# EAGLE design sharp_esp32s2_v1 (EAGLE 9.6.2)
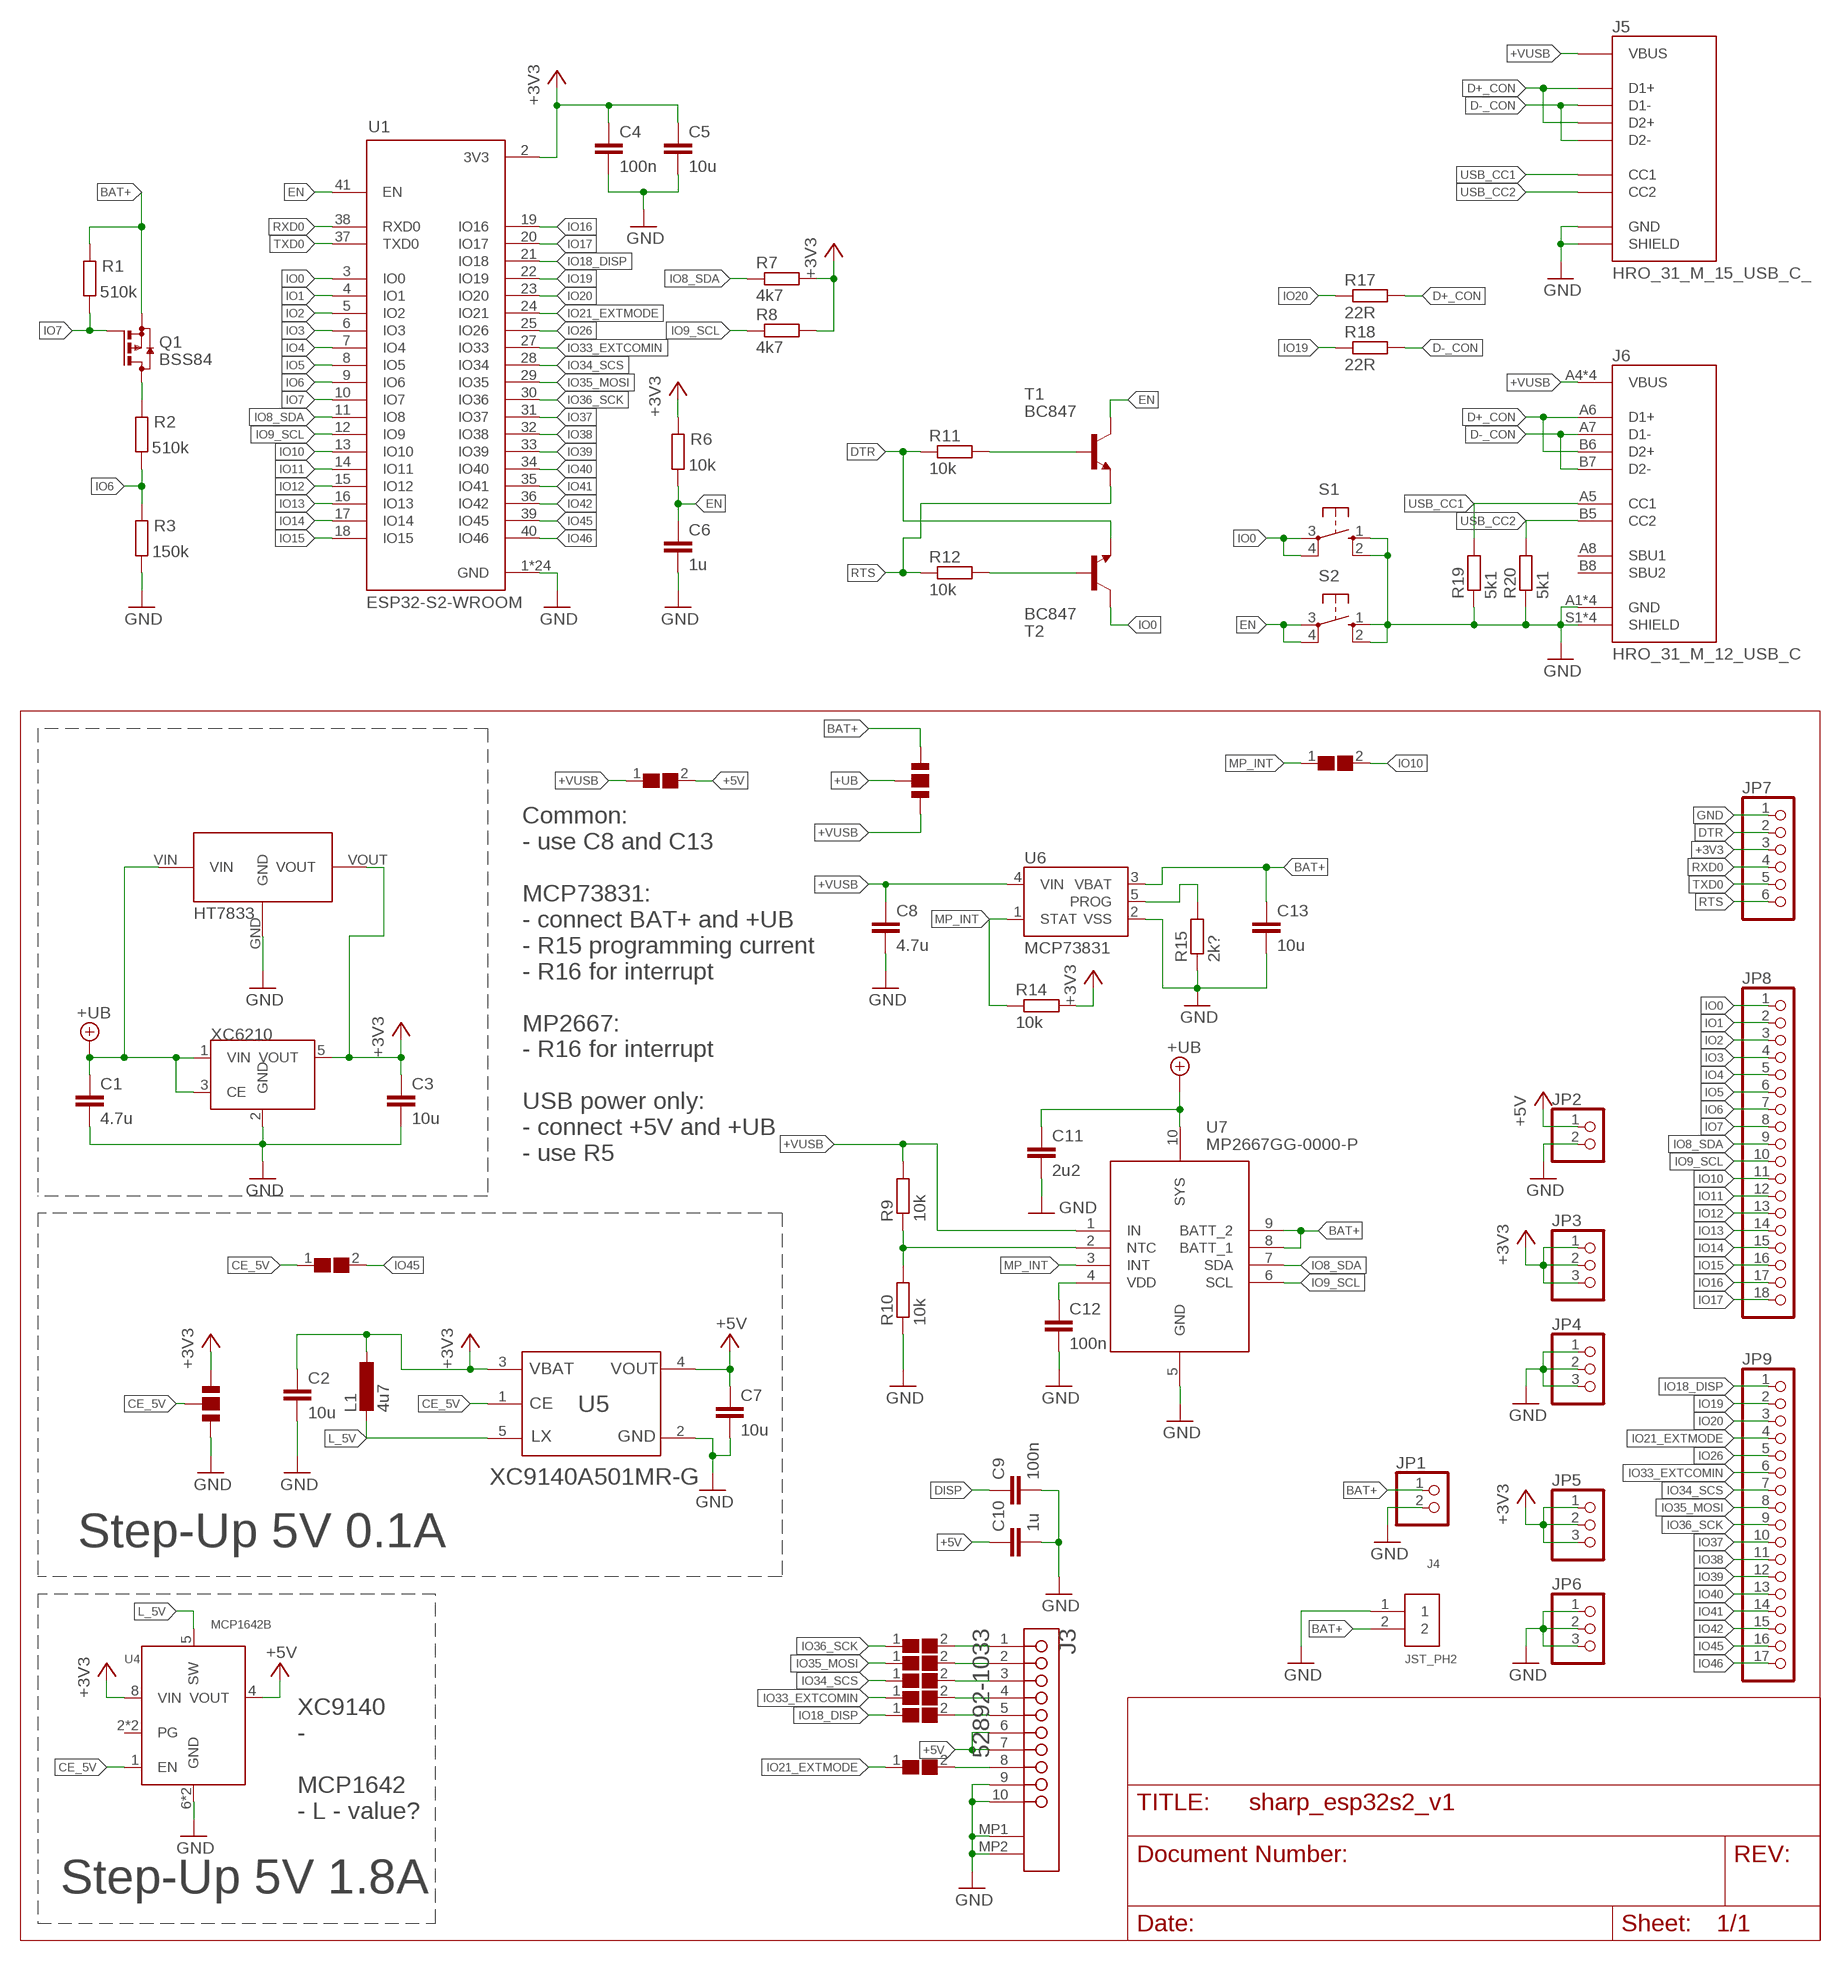
[diagram p0: schematic, sheet 1]

## Parts
C1  4.7u  C-EUC1206  [C1206]
C2  10u  C-EUC0603K  [C0603K]
C3  10u  C-EUC1206  [C1206]
C4  100n  C-EUC0603K  [C0603K]
C5  10u  C-EUC1206  [C1206]
C6  1u  C-EUC0603K  [C0603K]
C7  10u  C-EUC0603K  [C0603K]
C8  4.7u  C-EUC1206  [C1206]
C9  100n  C-EUC0603K  [C0603K]
C10  1u  C-EUC0603K  [C0603K]
C11  2u2  C-EUC1206  [C1206]
C12  100n  C-EUC0603K  [C0603K]
C13  10u  C-EUC1206  [C1206]
J1  JUMPER  [2-WAY]
J2  JUMPER  [2-WAY]
J3  MOLEX_52892-1033MOLEX_52892-1033_0_0  [MOLEX_52892-1033_0]
J4  JST_PH2  [JSTPH2]
J5  HRO_31_M_15_USB_C_  [HRO_31_M_15_USB_C]
J6  HRO_31_M_12_USB_C  [HRO_31_M_12_USB_C]
JP1  PINHD-1X2  [1X02]
JP2  PINHD-1X2  [1X02]
JP3  PINHD-1X3  [1X03]
JP4  PINHD-1X3  [1X03]
JP5  PINHD-1X3  [1X03]
JP6  PINHD-1X3  [1X03]
JP7  PINHD-1X6  [1X06]
JP8  PINHD-1X18  [1X18]
JP9  PINHD-1X17  [1X17]
L1  4u7  L-EUL3225M  [L3225M]
Q1  BSS84  [SOT23]
R1  510k  R-EU_R0603  [R0603]
R2  510k  R-EU_R0603  [R0603]
R3  150k  R-EU_R0603  [R0603]
R6  10k  R-EU_R0603  [R0603]
R7  4k7  R-EU_R0603  [R0603]
R8  4k7  R-EU_R0603  [R0603]
R9  10k  R-EU_R0603  [R0603]
R10  10k  R-EU_R0603  [R0603]
R11  10k  R-EU_R0603  [R0603]
R12  10k  R-EU_R0603  [R0603]
R14  10k  R-EU_R0603  [R0603]
R15  2k?  R-EU_R0603  [R0603]
R17  22R  R-EU_R0603  [R0603]
R18  22R  R-EU_R0603  [R0603]
R19  5k1  R-EU_R0603  [R0603]
R20  5k1  R-EU_R0603  [R0603]
S1  10-XX  [B3F-10XX]
S2  10-XX  [B3F-10XX]
T1  BC847  [SOT23]
T2  BC847  [SOT23]
U1  ESP32-S2-WROOM  [XCVR_ESP32-S2-WROOM]
U2  HT7833  [SOT89]
U3  XC6210  [SOT-23-5]
U4  MCP1642B  [MSOP8]
U5  TOREX_XC9140A501MR-GTOREX_XC9140A501MR-G_0_0  [TOREX_XC9140A501MR-G_0]
U6  MCP73831  [SOT95P290X120-5]
U7  MP2667GG-0000-P  [QFN50P200X200X105-10N]
U$1  SOLDER_JUMPER  [SOLDER_JUMPER]
U$2  SOLDER_JUMPER  [SOLDER_JUMPER]
U$3  SOLDER_JUMPER  [SOLDER_JUMPER]
U$4  SOLDER_JUMPER  [SOLDER_JUMPER]
U$5  SOLDER_JUMPER  [SOLDER_JUMPER]
U$6  SOLDER_JUMPER  [SOLDER_JUMPER]
U$7  SOLDER_JUMPER  [SOLDER_JUMPER]
U$8  SOLDER_JUMPER  [SOLDER_JUMPER]
U$9  SOLDER_JUMPER  [SOLDER_JUMPER]

## Nets
+3V3: C2.1 C3.1 C4.1 C5.1 J1.P$3 JP3.1 JP3.2 JP3.3 JP5.1 JP5.2 JP5.3 JP7.3 L1.1 R6.2 R7.2 R8.2 R14.2 U1.2(3V3) U2.VOUT U3.5(VOUT) U4.8(VIN) U5.3(VBAT)
+5V: C7.1 C10.1 J3.6 J3.7 JP2.1 U4.4(VOUT) U5.4(VOUT) U$7.2
+UB: C1.1 C11.1 J2.P$1 U2.VIN U3.1(VIN) U3.3(CE) U7.10(SYS)
+VUSB: C8.1 J2.P$2 J5.P$2(VBUS) J5.P$6(VBUS) J5.P$9(VBUS) J5.P$13(VBUS) J6.A4(VBUS) J6.A9(VBUS) J6.B4(VBUS) J6.B9(VBUS) R9.2 U6.4(VIN) U7.1(IN) U$7.1
BAT+: C13.1 J2.P$3 J4.2 JP1.1 Q1.2(S) R1.2 U6.3(VBAT) U7.8(BATT_1) U7.9(BATT_2)
CE_5V: J1.P$1 U4.1(EN) U5.1(CE) U$9.1
D+_CON: J5.P$4(D1+) J5.P$11(D2+) J6.A6(D1+) J6.B6(D2+) R17.2
D-_CON: J5.P$3(D1-) J5.P$10(D2-) J6.A7(D1-) J6.B7(D2-) R18.2
DISP: C9.1 J3.5 U$5.2
DTR: JP7.2 R11.1 T2.2(E)
EN: C6.1 R6.1 S2.3(P) S2.4(P1) T1.3(C) U1.41(EN)
GND: C1.2 C2.2 C3.2 C4.2 C5.2 C6.2 C7.2 C8.2 C9.2 C10.2 C11.2 C12.2 C13.2 J1.P$2 J3.9 J3.10 J3.MP1 J3.MP2 J4.1 J5.P$1(GND) J5.P$7(GND) J5.P$8(GND) J5.P$14(GND) J5.P$15(SHIELD) J5.P$16(SHIELD) J5.P$17(SHIELD) J5.P$18(SHIELD) J6.A1(GND) J6.A12(GND) J6.B1(GND) J6.B12(GND) J6.S1(SHIELD) J6.S2(SHIELD) J6.S3(SHIELD) J6.S4(SHIELD) JP1.2 JP2.2 JP4.1 JP4.2 JP4.3 JP6.1 JP6.2 JP6.3 JP7.1 R3.1 R10.1 R15.1 R19.1 R20.1 S1.1(S) S1.2(S1) S2.1(S) S2.2(S1) U1.1(GND) U1.26(GND) U1.42(GND) U1.43.1(GND) U1.43.2(GND) U1.43.3(GND) U1.43.4(GND) U1.43.5(GND) U1.43.6(GND) U1.43.7(GND) U1.43.8(GND) U1.43.9(GND) U1.43.10(GND) U1.43.11(GND) U1.43.12(GND) U1.43.13(GND) U1.43.14(GND) U1.43.15(GND) U1.43.16(GND) U1.43.17(GND) U1.43.18(GND) U1.43.19(GND) U1.43.20(GND) U1.43.21(GND) U2.GND U3.2(GND) U4.6(GND) U4.7(GND) U5.2(GND) U6.2(VSS) U7.5(GND)
IO0: JP8.1 S1.3(P) S1.4(P1) T2.3(C) U1.3(IO0)
IO1: JP8.2 U1.4(IO1)
IO2: JP8.3 U1.5(IO2)
IO3: JP8.4 U1.6(IO3)
IO4: JP8.5 U1.7(IO4)
IO5: JP8.6 U1.8(IO5)
IO6: JP8.7 R2.1 R3.2 U1.9(IO6)
IO7: JP8.8 Q1.1(G) R1.1 U1.10(IO7)
IO8_SDA: JP8.9 R7.1 U1.11(IO8) U7.7(SDA)
IO9_SCL: JP8.10 R8.1 U1.12(IO9) U7.6(SCL)
IO10: JP8.11 U1.13(IO10) U$8.2
IO11: JP8.12 U1.14(IO11)
IO12: JP8.13 U1.15(IO12)
IO13: JP8.14 U1.16(IO13)
IO14: JP8.15 U1.17(IO14)
IO15: JP8.16 U1.18(IO15)
IO16: JP8.17 U1.19(IO16)
IO17: JP8.18 U1.20(IO17)
IO18_DISP: JP9.1 U1.21(IO18) U$5.1
IO19: JP9.2 R18.1 U1.22(IO19)
IO20: JP9.3 R17.1 U1.23(IO20)
IO21_EXTMODE: JP9.4 U1.24(IO21) U$6.1
IO26: JP9.5 U1.25(IO26)
IO33_EXTCOMIN: JP9.6 U1.27(IO33) U$4.1
IO34_SCS: JP9.7 U1.28(IO34) U$3.1
IO35_MOSI: JP9.8 U1.29(IO35) U$2.1
IO36_SCK: JP9.9 U1.30(IO36) U$1.1
IO37: JP9.10 U1.31(IO37)
IO38: JP9.11 U1.32(IO38)
IO39: JP9.12 U1.33(IO39)
IO40: JP9.13 U1.34(IO40)
IO41: JP9.14 U1.35(IO41)
IO42: JP9.15 U1.36(IO42)
IO45: JP9.16 U1.39(IO45) U$9.2
IO46: JP9.17 U1.40(IO46)
L_5V: L1.2 U4.5(SW) U5.5(LX)
MP_INT: R14.1 U6.1(STAT) U7.3(INT) U$8.1
N$1: J3.2 U$2.2
N$4: J3.3 U$3.2
N$7: J3.4 U$4.2
N$8: Q1.3(D) R2.2
N$10: J3.8 U$6.2
N$14: R9.1 R10.2 U7.2(NTC)
N$17: R15.2 U6.5(PROG)
N$18: C12.1 U7.4(VDD)
N$28: R12.2 T2.1(B)
N$52: R11.2 T1.1(B)
RTS: JP7.6 R12.1 T1.2(E)
RXD0: JP7.4 U1.38(RXD0)
SCK: J3.1 U$1.2
TXD0: JP7.5 U1.37(TXD0)
USB_CC1: J5.P$5(CC1) J6.A5(CC1) R19.2
USB_CC2: J5.P$12(CC2) J6.B5(CC2) R20.2
Unconnected: J6.A8(SBU1) J6.B8(SBU2) U4.2(PG) U4.3(PG)

## Notes on the sheet
- Common:
  - use C8 and C13
  
  MCP73831:
  - connect BAT+ and +UB
  - R15 programming current
  - R16 for interrupt
  
  MP2667:
  - R16 for interrupt
  
  USB power only:
  - connect +5V and +UB
  - use R5
- Step-Up 5V 0.1A
- XC9140
  -
  
  MCP1642
  - L - value?
- Step-Up 5V 1.8A

## Library data of the parts
C1-C13 = rcl:C-EU: CAPACITOR, European symbol; SPICEPREFIX: C
J1 J2 = czech_maker:JUMPER
J3 = Bastlir:MOLEX_52892-1033: MOLX-52892-1033; CIIVA_IDS: 12958041; CIRCUITS_LOADED: 10; COMPONENT_LINK_1_DESCRIPTION: Manufacturer URL; COMPONENT_LINK_1_URL: http://www.molex.com/molex/index.jsp; COMPONENT_LINK_3_DESCRIPTION: Package Specification; COMPONENT_LINK_3_URL: http://www.molex.com/pdm_docs/sd/528921033_sd.pdf; CONTACT_POSITION: Bottom; CURRENT_MAX_PER_CONTACT: 0.5A; DATASHEET: http://www.molex.com/webdocs/datasheets/pdf/en-us/0528921033_FFC_FPC_CONNECTORS.pdf; DURABILITY_MATING_CYCLES_MAX: 20; ENTRY_ANGLE: 90degrees Angle; FOOTPRINT_VARIANT_NAME_0: Manufacturer Recommended; IMPORTED: yes; IMPORTED_FROM: vault; IMPORT_TS: 1521861772; MATED_HEIGHT: 2.00mm; MATERIAL___METAL: Phosphor Bronze; MATERIAL___PLATING_MATING: Silver, Tin-Bismuth; MATERIAL___PLATING_TERMINATION: Silver, Tin-Bismuth; MF: Molex; MOUNTING_TECHNOLOGY: Surface Mount; MPN: 52892-1033; NUMBER_OF_ROWS: 1; ORIENTATION: Right Angle; PACKAGE: 52892-1033; PACKAGE_DESCRIPTION: 10-Lead FPC Connector, Pitch 0.5 mm; PACKAGE_VERSION: Rev. A, 05/2013; PACKING: Tape and Reel; PCB_LOCATOR: No; PCB_RETENTION: Yes; PITCH___MATING_INTERFACE: 0.50mm; PITCH___TERMINATION_INTERFACE: 0.50mm; POLARIZED_TO_PCB: No; PREFIX: J; RELEASE_DATE: 1411372666; ROHS: Yes; STACKABLE: No; VAULT_GUID: ED90F1F9-BF1F-41FB-8C24-080009F071BA; VAULT_REVISION: 2519BB65-6747-4A90-BA56-D26D50506A67; VOLTAGE_MAX: 50V
J4 = Bastlir:JST_PH2
J5 = Bastlir:HRO_31_M_15_USB_C: datasheet <https://datasheet.lcsc.com/szlcsc/1811101526_Korean-Hroparts-Elec-TYPE-C-31-M-15_C223908.pdf>
J6 = Bastlir:HRO_31_M_12_USB_C: USB Shielded I/O Receptacle; Type C; Right Angle; Surface Mount; Gold over Nickel
JP1 JP2 = pinhead:PINHD-1X2: PIN HEADER
JP3-JP6 = pinhead:PINHD-1X3: PIN HEADER
JP7 = pinhead:PINHD-1X6: PIN HEADER
JP8 = pinhead:PINHD-1X18: PIN HEADER
JP9 = pinhead:PINHD-1X17: PIN HEADER
L1 = rcl:L-EU: INDUCTOR, European symbol; SPICEPREFIX: L
Q1 = transistor-small-signal:BSS84: P-CHANNEL MOS FET
R1-R3 R6-R12 R14 R15 R17-R20 = rcl:R-EU_: RESISTOR, European symbol; SPICEPREFIX: R
S1 S2 = switch-omron:10-XX: OMRON SWITCH; MPN: B3F-1000; OC_FARNELL: 176432; OC_NEWARK: 36M3542
T1 T2 = transistor:BC847: NPN TRANSISTOR
U1 = Bastlir:ESP32-S2-WROOM: WiFi 802.11b/g/n Transceiver Module 2.4GHz PCB Trace Surface Mount Check prices <https://pricing.snapeda.com/search/part/ESP32-S2-WROOM/?ref=eda>; AVAILABILITY: Bad; DESCRIPTION: WiFi 802.11b/g/n Transceiver Module 2.4GHz PCB Trace Surface Mount; MF: Espressif Systems; MP: ESP32-S2-WROOM; PACKAGE: VFQFN-56 Espressif Systems; PRICE: None
U2 = Bastlir:HT7833
U3 = Bastlir:XC6210
U4 = Bastlir:MCP1642B
U5 = Bastlir:TOREX_XC9140A501MR-G: Boost Switching Regulator IC Positive Fixed 5V 1 Output 295mA (Switch) SC-74A, SOT-753; AMBIENT_TEMPERATURE_RANGE_HIGH: +85°C; AMBIENT_TEMPERATURE_RANGE_LOW: -40°C; AUTOMOTIVE: No; CENTROID_NOT_SPECIFIED: No; DATASHEET: http://www.torexsemi.com/products/dcdc_converters/data/XC9140.pdf; DEVICE_CLASS_L1: Integrated Circuits (ICs); DEVICE_CLASS_L2: Power Management ICs; DEVICE_CLASS_L3: Voltage Regulators - Switching; DIGIKEY_DESCRIPTION: IC REG BOOST 5V 295MA SOT25; DIGIKEY_PART_NUMBER: 893-1181-1-ND; FOOTPRINT_PARAMETERS_1: {"fp_type":"SOT23","params":{"N":{"default":"5","long name":"Number of leads","type":"multichoice","short name":"N"},"A":{"nom":false,"long name":"Height","min":false,"max":1300000,"short name":"A","type":"measurement"},"A1":{"nom":50000,"long name":"Package clearance","min":0,"max":100000,"short name":"A1","type":"measurement"},"A2":{"nom":1100000,"long name":"Package height","min":1000000,"max":1200000,"short name":"A2","type":"measurement"},"D":{"nom":2900000,"long name":"Package length","min":2700000,"max":3100000,"short name":"D","type":"measurement"},"E":{"nom":2800000,"long name":"Width /w leads","min":2600000,"max":3000000,"short name":"E","type":"measurement"},"E1":{"nom":1600000,"long name":"Package width","min":1500000,"max":1800000,"short name":"E1","type":"measurement"},"B":{"nom":400000,"long name":"Lead width","min":350000,"max":500000,"short name":"B","type":"measurement"},"C":{"nom":150000,"long name":"Lead thickness","min":100000,"max":250000,"short name":"C","type":"measurement"},"L":{"nom":false,"long name":"Lead foot length","min":200000,"max":false,"short name":"L","type":"measurement"},"e":{"nom":950000,"long name":"Lead pitch","min":null,"max":null,"short name":"e","type":"measurement"},"PHI":{"nom":false,"long name":"Lead angle","min":0,"max":8,"short name":"PHI","type":"measurement"},"offset x":{"nom":0,"long name":"X Center offset","min":null,"max":null,"short name":"offset x","type":"measurement"},"offset y":{"nom":0,"long name":"Y Center offset","min":null,"max":null,"short name":"offset y","type":"measurement"},"LS":{"default":"Rounded rectangle","long name":"Land shape","type":"multichoice","short name":"LS"},"LS1":{"default":"Rectangle","long name":"Land shape (Pin 1)","type":"multichoice","short name":"LS1"},"solder toe":{"nom":550000,"long name":"Solder fillet (toe)","min":null,"max":null,"short name":"solder toe","type":"fixedmeasurement"},"solder heel":{"nom":450000,"long name":"Solder fillet (heel)","min":null,"max":null,"short name":"solder heel","type":"fixedmeasurement"},"solder side":{"nom":50000,"long name":"Solder fillet (side)","min":null,"max":null,"short name":"solder side","type":"fixedmeasurement"},"courtyard":{"nom":500000,"long name":"Courtyard","min":null,"max":null,"short name":"courtyard","type":"fixedmeasurement"},"SF":{"default":"A","long name":"Packing level","type":"multichoiceparent","short name":"SF","help":"http://support.upverter.com/customer/portal/articles/978783-what-is-a-footprint-packing-level","children":["solder toe","solder heel","solder side","courtyard"]}}}; FOOTPRINT_PARAMETERS_2: {"fp_type":"SOT23","params":{"N":{"default":"5","long name":"Number of leads","type":"multichoice","short name":"N"},"A":{"nom":false,"long name":"Height","min":false,"max":1300000,"short name":"A","type":"measurement"},"A1":{"nom":50000,"long name":"Package clearance","min":0,"max":100000,"short name":"A1","type":"measurement"},"A2":{"nom":1100000,"long name":"Package height","min":1000000,"max":1200000,"short name":"A2","type":"measurement"},"D":{"nom":2900000,"long name":"Package length","min":2700000,"max":3100000,"short name":"D","type":"measurement"},"E":{"nom":2800000,"long name":"Width /w leads","min":2600000,"max":3000000,"short name":"E","type":"measurement"},"E1":{"nom":1600000,"long name":"Package width","min":1500000,"max":1800000,"short name":"E1","type":"measurement"},"B":{"nom":400000,"long name":"Lead width","min":350000,"max":500000,"short name":"B","type":"measurement"},"C":{"nom":150000,"long name":"Lead thickness","min":100000,"max":250000,"short name":"C","type":"measurement"},"L":{"nom":false,"long name":"Lead foot length","min":200000,"max":false,"short name":"L","type":"measurement"},"e":{"nom":950000,"long name":"Lead pitch","min":null,"max":null,"short name":"e","type":"measurement"},"PHI":{"nom":false,"long name":"Lead angle","min":0,"max":8,"short name":"PHI","type":"measurement"},"offset x":{"nom":0,"long name":"X Center offset","min":null,"max":null,"short name":"offset x","type":"measurement"},"offset y":{"nom":0,"long name":"Y Center offset","min":null,"max":null,"short name":"offset y","type":"measurement"},"LS":{"default":"Rounded rectangle","long name":"Land shape","type":"multichoice","short name":"LS"},"LS1":{"default":"Rectangle","long name":"Land shape (Pin 1)","type":"multichoice","short name":"LS1"},"solder toe":{"nom":350000,"long name":"Solder fillet (toe)","min":null,"max":null,"short name":"solder toe","type":"fixedmeasurement"},"solder heel":{"nom":350000,"long name":"Solder fillet (heel)","min":null,"max":null,"short name":"solder heel","type":"fixedmeasurement"},"solder side":{"nom":30000,"long name":"Solder fillet (side)","min":null,"max":null,"short name":"solder side","type":"fixedmeasurement"},"courtyard":{"nom":250000,"long name":"Courtyard","min":null,"max":null,"short name":"courtyard","type":"fixedmeasurement"},"SF":{"default":"B","long name":"Packing level","type":"multichoiceparent","short name":"SF","help":"http://support.upverter.com/customer/portal/articles/978783-what-is-a-footprint-packing-level","children":["solder toe","solder heel","solder side","courtyard"]}}}; FOOTPRINT_PARAMETERS_3: {"fp_type":"SOT23","params":{"N":{"default":"5","long name":"Number of leads","type":"multichoice","short name":"N"},"A":{"nom":false,"long name":"Height","min":false,"max":1300000,"short name":"A","type":"measurement"},"A1":{"nom":50000,"long name":"Package clearance","min":0,"max":100000,"short name":"A1","type":"measurement"},"A2":{"nom":1100000,"long name":"Package height","min":1000000,"max":1200000,"short name":"A2","type":"measurement"},"D":{"nom":2900000,"long name":"Package length","min":2700000,"max":3100000,"short name":"D","type":"measurement"},"E":{"nom":2800000,"long name":"Width /w leads","min":2600000,"max":3000000,"short name":"E","type":"measurement"},"E1":{"nom":1600000,"long name":"Package width","min":1500000,"max":1800000,"short name":"E1","type":"measurement"},"B":{"nom":400000,"long name":"Lead width","min":350000,"max":500000,"short name":"B","type":"measurement"},"C":{"nom":150000,"long name":"Lead thickness","min":100000,"max":250000,"short name":"C","type":"measurement"},"L":{"nom":false,"long name":"Lead foot length","min":200000,"max":false,"short name":"L","type":"measurement"},"e":{"nom":950000,"long name":"Lead pitch","min":null,"max":null,"short name":"e","type":"measurement"},"PHI":{"nom":false,"long name":"Lead angle","min":0,"max":8,"short name":"PHI","type":"measurement"},"offset x":{"nom":0,"long name":"X Center offset","min":null,"max":null,"short name":"offset x","type":"measurement"},"offset y":{"nom":0,"long name":"Y Center offset","min":null,"max":null,"short name":"offset y","type":"measurement"},"LS":{"default":"Rounded rectangle","long name":"Land shape","type":"multichoice","short name":"LS"},"LS1":{"default":"Rectangle","long name":"Land shape (Pin 1)","type":"multichoice","short name":"LS1"},"solder toe":{"nom":150000,"long name":"Solder fillet (toe)","min":null,"max":null,"short name":"solder toe","type":"fixedmeasurement"},"solder heel":{"nom":250000,"long name":"Solder fillet (heel)","min":null,"max":null,"short name":"solder heel","type":"fixedmeasurement"},"solder side":{"nom":10000,"long name":"Solder fillet (side)","min":null,"max":null,"short name":"solder side","type":"fixedmeasurement"},"courtyard":{"nom":100000,"long name":"Courtyard","min":null,"max":null,"short name":"courtyard","type":"fixedmeasurement"},"SF":{"default":"C","long name":"Packing level","type":"multichoiceparent","short name":"SF","help":"http://support.upverter.com/customer/portal/articles/978783-what-is-a-footprint-packing-level","children":["solder toe","solder heel","solder side","courtyard"]}}}; FOOTPRINT_URL: https://www.torexsemi.com/file/SOT-25/SOT-25-pkg.pdf; FOOTPRINT_VARIANT_NAME_0: Recommended_Land_Pattern; FOOTPRINT_VARIANT_NAME_1: IPC_A; FOOTPRINT_VARIANT_NAME_2: IPC_B; FOOTPRINT_VARIANT_NAME_3: IPC_C; HEIGHT: 1.3mm; IPC_LAND_PATTERN_NAME: SOT95P280X130-5; IS_FEMALE: yes; LEAD_FREE: Yes; MAX_POWER_DISSIPATION: 250mW; MAX_SUPPLY_VOLTAGE: 5.5V; MF: Torex; MFG_PACKAGE_IDENT: 0; MFG_PACKAGE_IDENT_DATE: 0; MFG_PACKAGE_IDENT_REV: 0; MIN_SUPPLY_VOLTAGE: 0.7V; MOUSER_PART_NUMBER: 865-XC9140A501MR-G; MPN: XC9140A501MR-G; NOMINAL_SUPPLY_CURRENT: 6.3uA; NUMBER_OF_OUTPUTS: 1; OUTPUT_CURRENT: 100mA; OUTPUT_TYPE: Fixed; OUTPUT_VOLTAGE: 5V; PACKAGE: SOT25; PREFIX: U; ROHS: Yes; STANDOFF_HEIGHT: 0mm; SWITCHING_TOPOLOGY: Boost; TEMPERATURE_RANGE_HIGH: +85°C; TEMPERATURE_RANGE_LOW: -40°C; VERIFICATION_VERSION: 0.0.0.3
U6 = Bastlir:MCP73831
U7 = Bastlir:MP2667GG-0000-P: BATT CHARGER, 4.2V, -40 TO 125DEG C; Battery Type:Li-Ion, Li-Pol; Input Voltage:5V; Battery Charge Voltage:4.2V; Charge Current Max:1A; Battery IC Case Style:QFN; No. of Pins:10Pins; No. of Series Cells:1; Product Range:- RoHS Compliant: Yes Source: Datasheet; DESCRIPTION: BATT CHARGER, 4.2V, -40 TO 125DEG C; Battery Type:Li-Ion, Li-Pol; Input Voltage:5V; Battery Charge Voltage:4.2V; Charge Current Max:1A; Battery IC Case Style:QFN; No. of Pins:10Pins; No. of Series Cells:1; Product Range:- RoHS Compliant: Yes; HEIGHT: 1.05mm; MANUFACTURER_NAME: Monolithic Power Systems (MPS); MANUFACTURER_PART_NUMBER: MP2667GG-0000-P; MOUSER_PART_NUMBER: 946-MP2667GG-0000-P; MOUSER_PRICE-STOCK: https://www.mouser.co.uk/ProductDetail/Monolithic-Power-Systems-MPS/MP2667GG-0000-P?qs=%2F4dsY8i%2FUxK26ddm8WbL%252Bg%3D%3D
U$1-U$9 = Bastlir:SOLDER_JUMPER

## Board
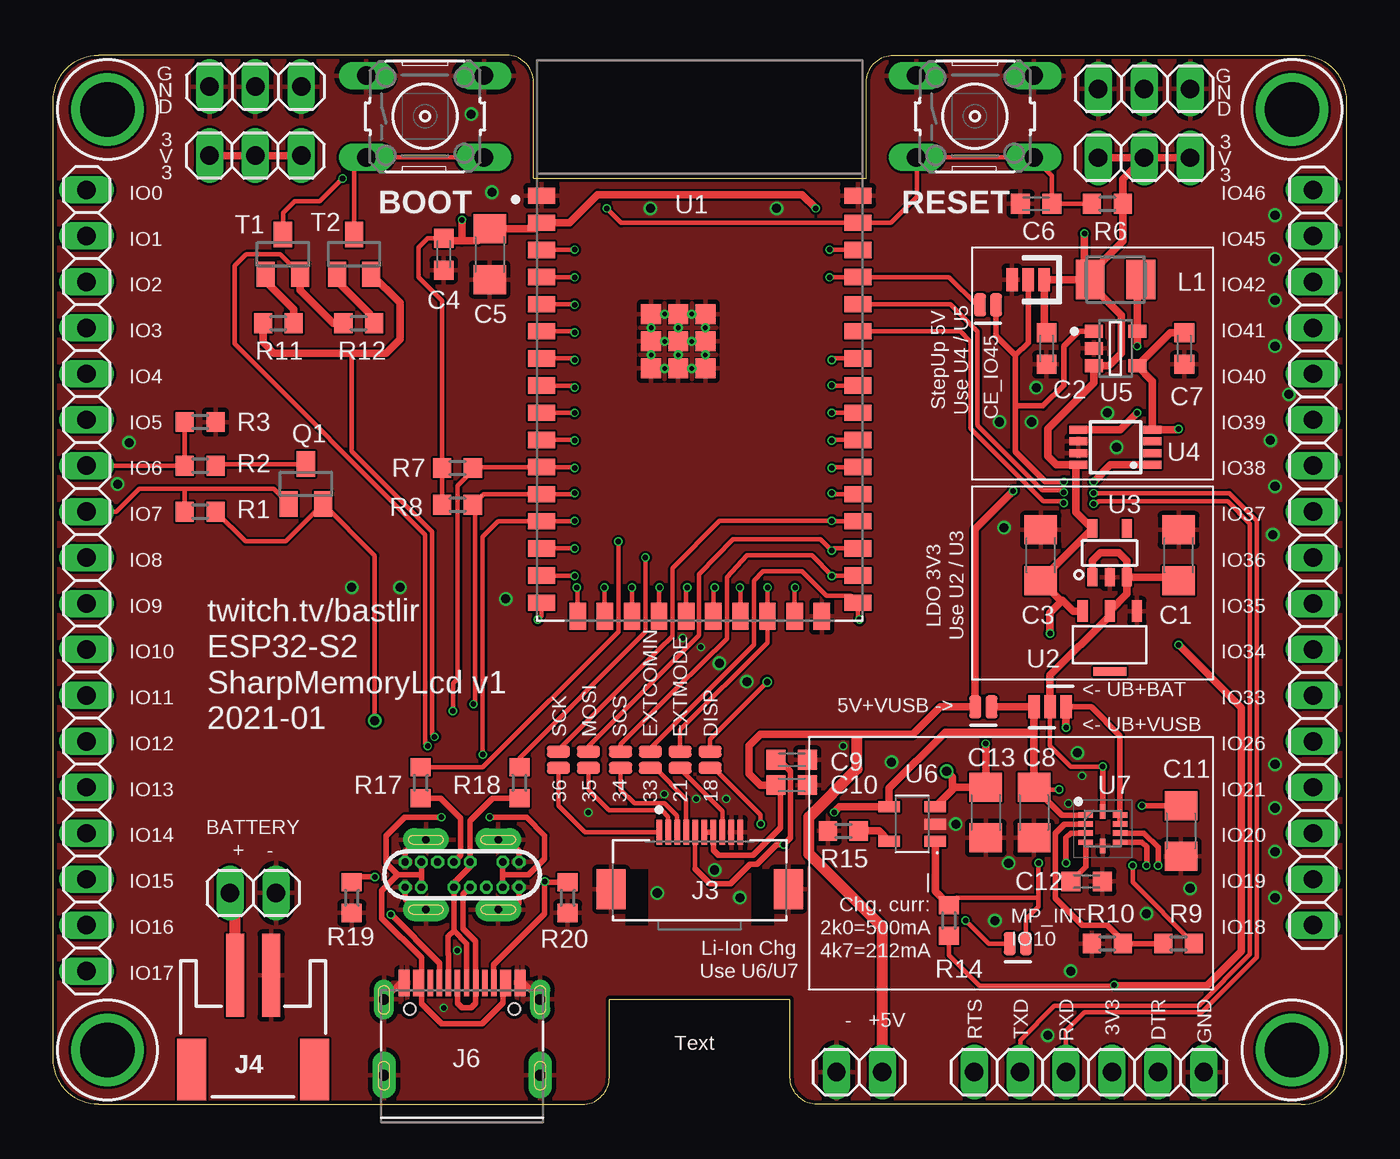
[diagram p1: board, top side]
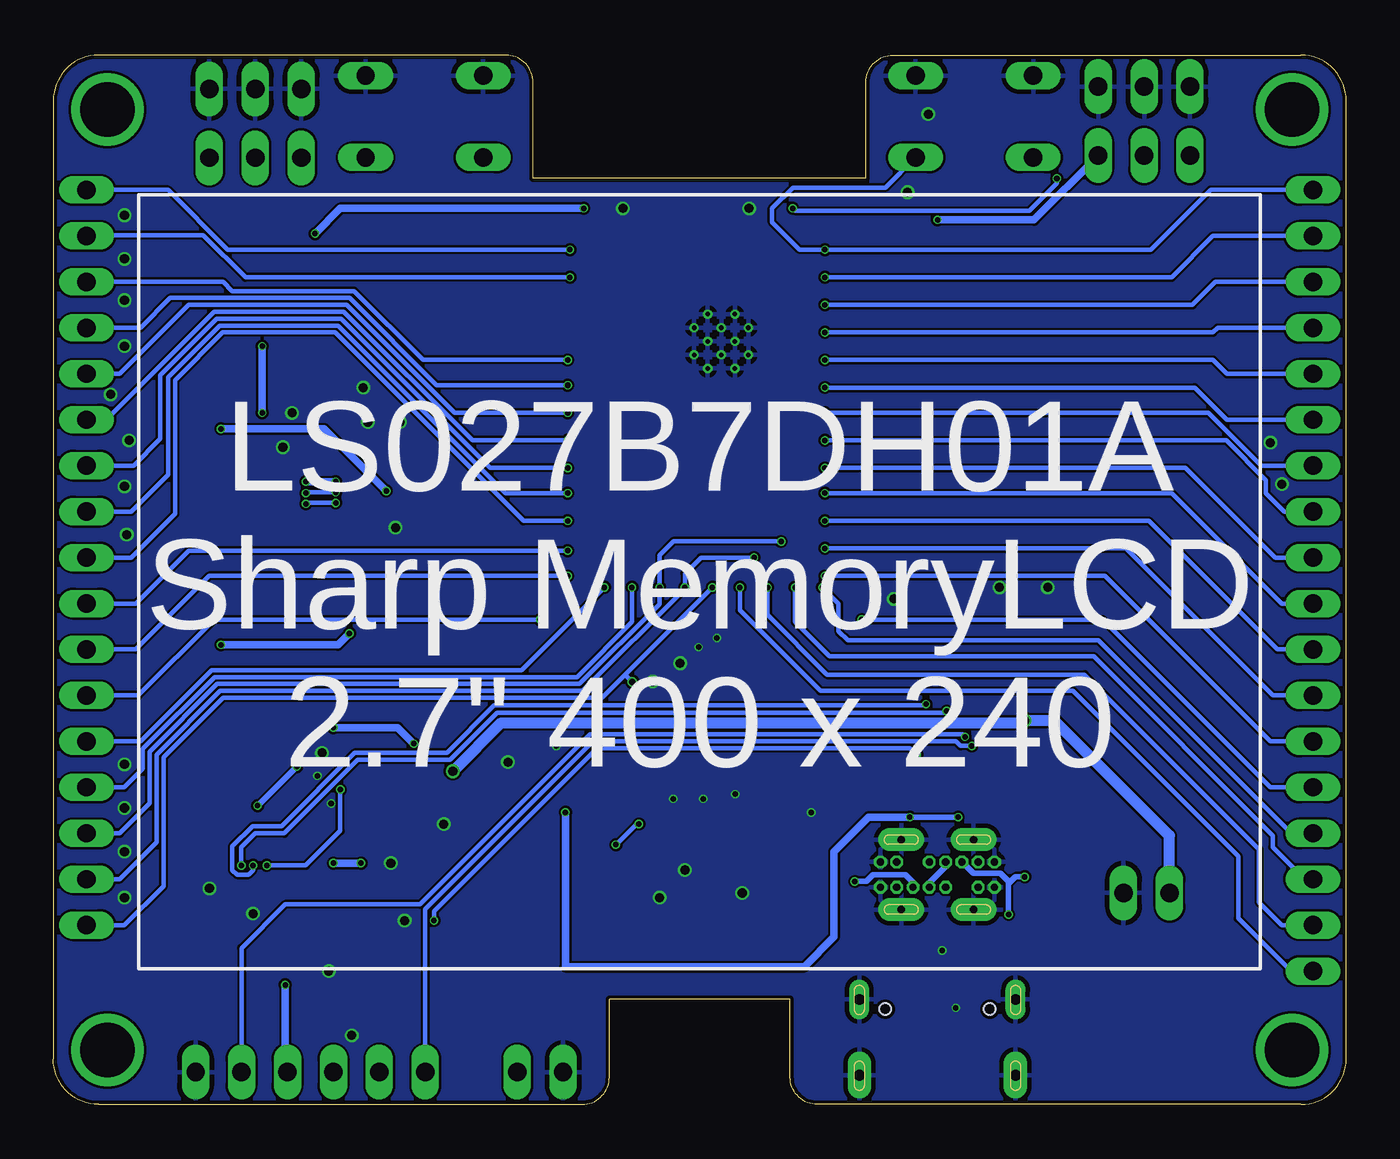
[diagram p2: board, bottom side, seen from below]

Size 71.5 x 58 mm. Coordinates in mm from the lower left corner, seen from the top.
Outline: 26.56,51.2 26.56,56.5 arc90 25.06,58 2.5,58 arc90 0,55.5 0,2.5 arc90 2.5,0 29.25,0 arc90 30.75,1.5 30.75,5.81 40.75,5.81 40.75,1.5 arc90 42.25,0 69,0 arc90 71.5,2.5 71.5,55.5 arc90 69,58 46.47,58 arc90 44.97,56.5 44.97,51.2 26.56,51.2
Copper layers (1*16): Top 0.035559375mm / dielectric 1.6mm / Bottom 0.035559375mm
Design rules "jlcpcb2layer": minimum track width 5mil, minimum drill 12mil, track to track 5mil, track to pad 5mil, pad to pad 5mil, via to via 5mil, smd to smd 5mil, copper to edge 8mil, drill to drill 6mil, minimum pad ring 5mil, minimum via ring 3mil, stop-mask expansion 2.5mil, vias tented up to drill 0mil, thermal gap 10mil

### Footprints (pad centres in the part's own frame; a part is rotated, then mirrored left to right if it is on the bottom)
C1206 = smd 1.6 x 1.8: 1 -1.4,0; 2 1.4,0
C0603K = smd 1.05 x 1.08: 1 -0.875,0; 2 0.875,0
2-WAY = smd 0.635 x 1.27: P$1 0,0; P$2 0.889,0; P$3 -0.889,0
MOLEX_52892-1033_0 = smd 0.3 x 1.4: 1 -2.25,1.575; 2 -1.75,1.575; 3 -1.25,1.575; 4 -0.75,1.575; 5 -0.25,1.575; 6 0.25,1.575; 7 0.75,1.575; 8 1.25,1.575; 9 1.75,1.575; 10 2.25,1.575 | smd 1.6 x 2.2: MP1 -4.9,-1.575; MP2 4.9,-1.575
JSTPH2 = smd 1 x 4.6: 1 -1,-3.7; 2 1,-3.7 | smd 1.6 x 3.4: NC1 -3.4,1.5; NC2 3.4,1.5
HRO_31_M_15_USB_C = drill 0.4 pad 0.7 octagon: P$1 3.15,0.7; P$2 2.25,0.7; P$3 0.45,0.7; P$4 -0.45,0.7; P$5 -1.35,0.7; P$6 -2.25,0.7; P$7 -3.15,0.7; P$8 -3.15,-0.7; P$9 -2.25,-0.7; P$10 -0.45,-0.7; P$11 0.45,-0.7; P$12 1.35,-0.7; P$13 2.25,-0.7; P$14 3.15,-0.7 | drill 0.4 pad 1.27 long: P$15 2,1.93; P$16 -2,1.93; P$17 2,-1.93; P$18 -2,-1.93
HRO_31_M_12_USB_C = smd 0.3 x 1.45: A1 -3.35,4.045; A4 -2.55,4.045; A5 -1.25,4.045; A6 -0.25,4.045; A7 0.25,4.045; A8 1.25,4.045; A9 2.55,4.045; A12 3.35,4.045; B1 3.05,4.045; B4 2.25,4.045; B5 1.75,4.045; B6 0.75,4.045; B7 -0.75,4.045; B8 -1.75,4.045; B9 -2.25,4.045; B12 -3.05,4.045 | drill 0.6 pad 1.1 long: S1 -4.32,3.13; S2 4.32,3.13 | drill 0.6 pad 1.3 long: S3 -4.32,-1.05; S4 4.32,-1.05 | hole 0.65: -2.89,2.6; 2.89,2.6
1X02 = drill 1.016 long: 1 -1.27,0; 2 1.27,0
1X03 = drill 1.016 long: 1 -2.54,0; 2 0,0; 3 2.54,0
1X06 = drill 1.016 long: 1 -6.35,0; 2 -3.81,0; 3 -1.27,0; 4 1.27,0; 5 3.81,0; 6 6.35,0
1X18 = drill 1.016 long: 1 -21.59,0; 2 -19.05,0; 3 -16.51,0; 4 -13.97,0; 5 -11.43,0; 6 -8.89,0; 7 -6.35,0; 8 -3.81,0; 9 -1.27,0; 10 1.27,0; 11 3.81,0; 12 6.35,0; 13 8.89,0; 14 11.43,0; 15 13.97,0; 16 16.51,0; 17 19.05,0; 18 21.59,0
1X17 = drill 1.016 long: 1 -20.32,0; 2 -17.78,0; 3 -15.24,0; 4 -12.7,0; 5 -10.16,0; 6 -7.62,0; 7 -5.08,0; 8 -2.54,0; 9 0,0; 10 2.54,0; 11 5.08,0; 12 7.62,0; 13 10.16,0; 14 12.7,0; 15 15.24,0; 16 17.78,0; 17 20.32,0
L3225M = smd 1.6 x 2.2: 1 -1.4,0; 2 1.4,0
SOT23 = smd 1 x 1.4: 1 -0.95,-1.1; 2 0.95,-1.1; 3 0,1.1
R0603 = smd 1 x 1.1: 1 -0.85,0; 2 0.85,0
B3F-10XX = drill 1.016 long: 1 -3.251,2.261; 2 3.251,2.261; 3 -3.251,-2.261; 4 3.251,-2.261
XCVR_ESP32-S2-WROOM = smd 1.5 x 0.9: 1 -8.75,8; 2 -8.75,6.5; 3 -8.75,5; 4 -8.75,3.5; 5 -8.75,2; 6 -8.75,0.5; 7 -8.75,-1; 8 -8.75,-2.5; 9 -8.75,-4; 10 -8.75,-5.5; 11 -8.75,-7; 12 -8.75,-8.5; 13 -8.75,-10; 14 -8.75,-11.5; 15 -8.75,-13; 16 -8.75,-14.5; 27 8.75,-14.5; 28 8.75,-13; 29 8.75,-11.5; 30 8.75,-10; 31 8.75,-8.5; 32 8.75,-7; 33 8.75,-5.5; 34 8.75,-4; 35 8.75,-2.5; 36 8.75,-1; 37 8.75,0.5; 38 8.75,2; 39 8.75,3.5; 40 8.75,5; 41 8.75,6.5; 42 8.75,8 | smd 0.9 x 1.5: 17 -6.75,-15.25; 18 -5.25,-15.25; 19 -3.75,-15.25; 20 -2.25,-15.25; 21 -0.75,-15.25; 22 0.75,-15.25; 23 2.25,-15.25; 24 3.75,-15.25; 25 5.25,-15.25; 26 6.75,-15.25 | smd 1.1 x 1.1: 43.1 -1.19,-0.05; 43.2 -2.69,-0.05; 43.3 0.31,-0.05; 43.4 -2.69,-1.55; 43.5 -1.19,-1.55; 43.6 0.31,-1.55; 43.7 -2.69,1.45; 43.8 -1.19,1.45; 43.9 0.31,1.45 | drill 0.25 pad 0.4: 43.10 -1.19,0.7; 43.11 -2.69,0.7; 43.12 0.31,0.7; 43.13 -2.69,-0.8; 43.14 -1.19,-0.8; 43.15 0.31,-0.8; 43.16 -1.94,1.45; 43.17 -0.44,1.45; 43.18 -1.94,-0.05; 43.19 -0.44,-0.05; 43.20 -1.94,-1.55; 43.21 -0.44,-1.55
SOT89 = smd 0.559 x 1.194: GND -1.499,-0.597; VIN 0,-0.597; VOUT 1.499,-0.597 | smd 1.829 x 0.457: P$4 0,2.743
SOT-23-5 = smd 1 x 0.55: 1 -1.35,0.95; 2 -1.35,0; 3 -1.35,-0.95; 4 1.35,-0.95; 5 1.35,0.95
MSOP8 = smd 0.45 x 1: 1 -0.975,-2.05; 2 -0.325,-2.05; 3 0.325,-2.05; 4 0.975,-2.05; 5 0.975,2.05; 6 0.325,2.05; 7 -0.325,2.05; 8 -0.975,2.05
TOREX_XC9140A501MR-G_0 = smd 1 x 0.7: 1 -1.2,0.95; 2 -1.2,0; 3 -1.2,-0.95; 4 1.2,-0.95; 5 1.2,0.95
SOT95P290X120-5 = smd 1.18 x 0.609: 1 -1.274,0.95; 2 -1.274,0; 3 -1.274,-0.95; 4 1.274,-0.95; 5 1.274,0.95
QFN50P200X200X105-10N = smd 0.8 x 0.3: 1 -0.95,0.75; 2 -0.95,0.25; 3 -0.95,-0.25; 4 -0.95,-0.75; 6 0.95,-0.75; 7 0.95,-0.25; 8 0.95,0.25; 9 0.95,0.75 | smd 0.3 x 0.8: 5 0,-0.95; 10 0,0.95
SOLDER_JUMPER = smd 0.66 x 1.27: 1 -0.445,0; 2 0.445,0

### Placement (x,y rotation side)
C1  62.23,30.35 90 top
C2  54.93,41.78 270 top
C3  54.61,30.35 90 top
C4  21.59,46.99 270 top
C5  24.13,46.99 270 top
C6  54.36,49.78 180 top
C7  62.55,41.78 270 top
C8  54.23,16.13 270 top
C9  40.83,19.05 0 top
C10  40.83,17.65 0 top
C11  62.36,15.11 270 top
C12  57.15,12.32 0 top
C13  51.56,16.13 270 top
J1  53.91,45.59 180 top
J2  55.12,21.97 180 top
J3  35.75,13.46 0 top
J4  11.05,3.43 180 top
J5  22.61,12.7 0 top
J6  22.61,2.67 0 top
JP1  11.05,11.68 0 top
JP2  44.58,1.78 180 top
JP3  60.33,52.32 180 top
JP4  60.33,56.13 0 top
JP5  11.18,52.45 180 top
JP6  11.18,56.26 0 top
JP7  57.28,1.78 180 top
JP8  1.84,28.96 270 top
JP9  69.66,30.23 90 top
L1  58.74,45.59 0 top
Q1  13.97,34.29 0 top
R1  8.13,32.77 0 top
R2  8.13,35.31 0 top
R3  8.13,37.72 180 top
R6  58.29,49.78 0 top
R7  22.35,35.18 180 top
R8  22.35,33.15 180 top
R9  62.23,8.89 0 top
R10  58.29,8.89 0 top
R11  12.45,43.18 0 top
R12  16.89,43.18 0 top
R14  49.53,10.16 270 top
R15  43.69,15.11 0 top
R17  20.32,17.78 270 top
R18  25.78,17.78 270 top
R19  16.51,11.43 90 top
R20  28.45,11.43 90 top
S1  20.56,54.61 0 top
S2  50.97,54.61 0 top
T1  12.7,46.99 0 top
T2  16.64,46.99 0 top
U1  35.75,42.23 0 top
U2  58.42,26.67 180 top
U3  58.42,30.48 90 top
U4  58.74,36.32 90 top
U5  58.74,41.78 0 top
U6  47.5,15.49 180 top
U7  58.04,15.24 0 top
U$1  27.94,19.05 270 top
U$2  29.59,19.05 270 top
U$3  31.37,19.05 270 top
U$4  33.02,19.05 270 top
U$5  36.32,19.05 270 top
U$6  34.67,19.05 270 top
U$7  51.44,21.97 180 top
U$8  53.34,8.89 180 top
U$9  51.69,44.2 180 top

### Tracks (layer width: path | path; a pad name or v marks a point on that pad's centre or on a via)
+3V3  (via drill 0.3)
  Top 0.254: C2.1 54.8,42.78 | 57.34,45.34 L1.1 | R8.2 R7.2 21.5,44.41 20.19,45.72 20.19,47.37 20.7,47.88 21.58,47.88 C4.1 | R14.2 49.53,8.26 51.22,6.56 58.72,6.56
  Top 0.406: JP3.2 59.14,51.14 R6.2 59.14,47.71 57.02,45.59 | JP3.3 JP3.2 | JP3.2 JP3.1 | 57.02,45.59 J1.P$3 54.8,42.78 | 57.02,45.59 L1.1 57.02,45.91 v57.02,48.13 | 57.34,45.34 59.05,43.62 59.05,41.53 58.36,40.83 U5.3 57.54,39.88 54.99,37.34 54.99,35.81 55.46,35.35 U4.8 56.56,35.22 56.56,32.74 U3.5 54.61,28.97 C3.1 55.75,27.81 | U2.VOUT 56.42,27.27 55.81,27.88 55.75,27.81 | 22.61,47.74 23.48,47.74 C5.1 26.66,48.39 U1.2 28.54,48.73 30.1,50.29 41.4,50.29 v42.16,49.53 | 22.61,47.74 21.72,47.74 C4.1 | JP5.3 JP5.2 JP5.1 | v22.61,48.9 22.61,47.74 | 55.75,27.81 55.12,27.18 v55.12,26.04 | v62.23,25.4 65.71,21.92 65.71,8.47 63.8,6.56 58.72,6.56 v58.67,6.6
  Bottom 0.406: JP5.1 17.27,48.9 v22.61,48.9 | v42.16,49.53 55.63,49.53 v57.02,48.13 | v55.12,26.04 55.75,25.4 v62.23,25.4 | v58.67,6.6 58.67,1.91 JP7.3
+5V  (via drill 0.3)
  Top 0.305: J3.6 J3.7 36.5,14.05 36.78,13.77 38.68,13.77 40.21,15.29 40.21,17.4 C10.1
  Top 0.406: C7.1 61.76,42.66 U5.4 60.79,39.98 U4.4 62.19,37.3 v62.23,37.34 | v53.09,33.91 50.97,31.79 50.97,22 U$7.2 49.06,21.97 47.54,20.45 44.32,20.45 | C10.1 39.12,17.65 38.48,18.29 38.48,19.81 39.12,20.45 44.32,20.45 | 44.45,20.32 44.32,20.45
  Top 0.61: JP2.1 45.85,9.78 41.78,13.84 41.78,15.88 44.45,18.54 44.45,20.32
  Bottom 0.406: v62.23,37.34 56.52,37.34 v53.09,33.91
+UB  (via drill 0.3)
  Top 0.254: J2.P$1 55.12,19.81 56.26,18.67 v58.04,18.67
  Top 0.305: U7.10 v58.04,18.67 | v60.2,16.51 C11.1
  Top 0.406: U3.3 62.05,29.13 C1.1 | U3.1 57.47,30.04 57.91,30.48 58.93,30.48 59.37,30.04 U3.3 | U3.3 59.37,28.22 U2.VIN 58.42,27.01 55.12,23.71 J2.P$1
  Bottom 0.305: v58.04,18.67 v60.2,16.51
+VUSB  (via drill 0.3)
  Top 0.254: R9.2 59.69,12.28 v59.69,13.21 | v55.63,17.4 54.36,17.4 C8.1
  Top 0.305: U7.1 55.77,15.99 C8.1 | J6.A9 J6.B4 24.87,6.7 24.87,5.61 23.71,4.45 21.46,4.45 20.36,5.55 J6.B9 | J6.A4 J6.B9 | J5.P$6 20.36,12.7 | 20.36,12.7 J5.P$9 | 20.36,12.7 19.05,12.7 | 19.05,12.7 18.16,11.81 18.16,10.29 20.36,8.09 J6.B9 | J5.P$13 24.86,12.7 | 24.86,12.7 J5.P$2 | 24.86,12.7 26.29,12.7 27.18,13.59 27.18,14.86 26.16,15.88 v24.13,15.88 | v21.46,15.88 19.43,15.88 18.41,14.86 18.41,13.34 19.05,12.7
  Top 0.406: C8.1 54.23,20.57 | 54.23,20.57 J2.P$2 U$7.1 | 54.23,20.57 49.34,20.57 46.22,17.46 U6.4 43.48,16.44 v43.18,16.15
  Bottom 0.254: v59.69,13.21 57.53,13.21 55.63,15.11 v55.63,17.4
  Bottom 0.305: v24.13,15.88 v21.46,15.88
  Bottom 0.406: v43.18,16.15 43.18,7.62 29.97,7.62 28.32,9.27 28.32,13.97 26.42,15.88 v24.13,15.88
BAT+  (via drill 0.3, 0.5)
  Top 0.254: R1.2 10.63,31.11 12.85,31.11 Q1.2 17.78,30.33 v17.78,21.21
  Top 0.305: U7.8 U7.9 58.99,20.39 57.4,21.97 J2.P$3
  Top 0.406: U6.3 49.73,17.4 | 49.73,17.4 49.86,17.53 C13.1 v51.56,19.94 | v49.4,18.41 49.73,18.09 49.73,17.4 | v56.01,20.83 J2.P$3
  Top 0.61: J4.2 10.05,11.41 JP1.1
  Bottom 0.406: v51.56,19.94 52.45,20.83 v56.01,20.83
  Bottom 0.61: JP1.1 9.78,14.86 16.13,21.21 v17.78,21.21 17.91,21.08 46.74,21.08 v49.4,18.41
CE_5V  (via drill 0.3)
  Top 0.305: U5.1 56.7,42.73 55.88,41.91 55.88,39.75 54.74,38.61 53.21,38.61 | v55.88,34.42 54.86,34.42 53.21,36.07 53.21,38.61 | U$9.1 52.13,42.48 53.21,41.4 | 53.21,38.61 53.21,41.4 | 53.21,41.4 53.91,42.1 J1.P$1
  Top 0.406: U4.1 58.46,35.35 v57.53,34.42
  Bottom 0.406: v57.53,34.42 v55.88,34.42
D+_CON
  Top 0.305: J5.P$4 22.54,13.78 22.54,15.82 21.42,16.93 R17.2 | J6.A6 22.36,5.58 22.61,5.33 23.11,5.33 23.36,5.58 J6.B6 23.36,9.03 22.68,9.71 22.68,11.62 J5.P$11
  Bottom 0.305: J5.P$4 22.16,13.15 23.06,12.25 J5.P$11
D-_CON
  Top 0.305: R18.2 24.3,16.93 23.06,15.69 J5.P$3 23.06,13.15 22.16,12.25 J5.P$10 22.16,9.59 | J6.A7 22.86,8.29 22.86,8.3 22.86,8.89 22.16,9.59 | J6.B7 21.86,8.29 21.84,8.3 21.84,9.28 22.16,9.59
DISP  (via drill 0.3)
  Top 0.254: v39.12,15.49 39.12,16 36.51,18.61 U$5.2 | J3.5 35.5,13.01
  Top 0.305: 35.5,13.01 36.32,12.19 37.46,12.19 38.54,13.27 38.92,13.27 40.01,14.35 v40.39,14.35 40.77,14.73 40.77,18.41 40.13,19.05 C9.1
  Bottom 0.254: v39.12,15.49 39.24,15.49 v40.39,14.35
DTR  (via drill 0.3)
  Top 0.254: 16.51,41.53 16.51,36.1 20.95,31.65 20.95,20.45 v21.08,20.32
  Top 0.406: R11.1 11.6,42.12 12.19,41.53 16.51,41.53 18.41,41.53 19.18,42.29 19.18,44.3 T2.2
  Bottom 0.254: JP7.2 61.09,8.64 58.67,11.05 51.21,11.05 41.81,20.45 21.21,20.45 v21.08,20.32
EN  (via drill 0.3)
  Top 0.254: R6.1 C6.1 55.23,51.34 S2.4 S2.3 47.75,52.32 47.75,50.16 46.32,48.73 U1.41 31.41,48.73 v30.61,49.53 | v16,51.18 14.73,49.91 13.34,49.91 12.7,49.28 T1.3
  Bottom 0.254: v30.61,49.53 30.48,49.4 17.53,49.4 16,50.93 v16,51.18
GND  (via drill 0.3, 0.5)
  Top 0.305: J6.B12 J6.A1 19.2,6.71 J6.S1 | J6.S2 26.01,6.71 J6.A12 J6.B1 | J5.P$1 25.76,13.99 25.11,14.63 J5.P$15 | J5.P$14 25.76,11.16 25.37,10.77 J5.P$17 | J5.P$8 19.46,11.37 20.05,10.77 J5.P$18 | J5.P$16 20.18,14.63 19.46,13.91 J5.P$7
  other vias: 33.02,49.53 40.01,49.53 58.29,38.23 52.58,31.88 56.64,19.43 46.35,18.92 37.97,11.43 24.26,50.42 23.11,54.74 54.36,39.62 54.1,37.72 52.32,37.72 49.91,15.49 33.4,11.68 36.58,12.95 38.35,23.37 36.83,24.38 34.8,25.78 35.81,25.27 67.56,46.74 67.56,49.15 67.56,44.45 68.33,39.24 67.31,36.7 56.26,7.37 54.99,3.81 60.45,10.54 62.87,11.94 52.83,13.34 52.07,10.16 58.8,36.32 56.13,16.64 56.9,18.16 21.59,5.33 22.35,8.51 67.56,34.16 67.44,31.5 67.56,41.91 67.56,18.8 67.56,16.38 67.56,13.97 67.56,11.43 25.02,27.94 16.51,28.57 19.18,28.57 4.19,36.58 3.56,34.29 33.78,17.14 35.56,16.89 29.59,16.13 37.21,16.89 43.69,19.81
  pour Top: -2.54,-2.54 74.93,-2.54 74.93,59.69 -2.54,59.69
  pour Bottom: -1.27,-1.27 73.66,-1.27 73.66,58.42 -1.27,58.42
IO0  (via drill 0.3)
  Top 0.254: T2.3 16.64,51.68 S1.3 S1.4 | U1.3 28.82,47.23 v28.83,47.24
  Bottom 0.254: JP8.1 7.49,50.55 10.79,47.24 v28.83,47.24 30.23,47.24 31.75,48.77 31.75,49.53 30.61,50.67 25.49,50.67 S1.4
IO1  (via drill 0.3)
  Top 0.254: U1.4 28.82,45.73 v28.83,45.72
  Bottom 0.254: v28.83,45.72 9.65,45.72 7.37,48.01 JP8.2
IO2  (via drill 0.3)
  Top 0.254: U1.5 28.8,44.23 v28.83,44.2
  Bottom 0.254: v28.83,44.2 8.51,44.2 7.24,45.47 JP8.3
IO3  (via drill 0.3)
  Top 0.254: U1.6 28.77,42.73 v28.83,42.67
  Bottom 0.254: v28.83,42.67 7.37,42.67 7.11,42.93 JP8.4
IO4  (via drill 0.3)
  Top 0.254: U1.7 28.75,41.23 v28.83,41.15
  Bottom 0.254: v28.83,41.15 7.37,41.15 6.6,40.39 JP8.5
IO5  (via drill 0.3)
  Top 0.254: U1.8 28.72,39.73 v28.83,39.62
  Bottom 0.254: v28.83,39.62 8.38,39.62 6.6,37.85 JP8.6
IO6  (via drill 0.3)
  Top 0.254: JP8.7 R2.1 R3.2 | U1.9 v28.83,38.23
  Bottom 0.254: v28.83,38.23 7.62,38.23 4.7,35.31 JP8.7
IO7  (via drill 0.3)
  Top 0.254: Q1.1 12.17,34.04 7.24,34.04 | JP8.8 3.49,32.77 4.76,34.04 7.24,34.04 | R1.1 7.28,34 7.24,34.04 | U1.10 28.8,36.73 v28.83,36.7
  Bottom 0.254: v28.83,36.7 6.63,36.7 4.45,34.51 4.45,33.78 3.43,32.77 JP8.8
IO8_SDA  (via drill 0.3)
  Top 0.254: v28.83,35.18 28.78,35.23 U1.11 23.25,35.23 R7.1 23.2,35.05 22.35,34.2 22.35,23.52 22.1,23.27 v22.1,21.74
  Top 0.305: U7.7 60.32,14.99 61.1,14.21 v61.1,13.21
  Bottom 0.254: v28.83,35.18 8.89,35.18 3.94,30.23 JP8.9 | v22.1,21.74 22.2,21.64 46.97,21.64 49.56,19.04 54.66,19.04 58.72,14.99 60.33,14.99 61.1,14.21 v61.1,13.21
IO9_SCL  (via drill 0.3)
  Top 0.254: v28.83,33.78 28.78,33.73 U1.12 23.79,33.73 R8.1 23.33,33.02 23.33,22.21 v23.24,22.12
  Top 0.305: U7.6 60.21,14.49 60.46,14.24 60.46,13.22 v60.45,13.21
  Bottom 0.254: v28.83,33.78 9.65,33.78 3.56,27.69 JP8.10 | v23.24,22.12 23.34,22.05 47.12,22.05 49.72,19.43 54.82,19.43 58.88,15.37 60.48,15.37 61.59,14.26 61.59,12.95 61.34,12.7 60.71,12.7 60.45,12.95 v60.45,13.21
IO10  (via drill 0.3)
  Top 0.254: v28.83,32.26 28.8,32.23 U1.13 24.61,32.23 23.75,31.37 v23.75,19.33 | v50.44,10.16 50.83,9.78 50.84,9.78 51.73,8.89 U$8.2
  Bottom 0.254: v28.83,32.26 10.92,32.26 3.81,25.15 JP8.11 | v23.75,19.33 23.77,19.33 24.13,19.68 41.43,19.68 50.44,10.67 v50.44,10.16
IO11  (via drill 0.3)
  Top 0.254: U1.14 v28.82,30.73 v28.83,30.73
  Bottom 0.254: v28.83,30.73 12.19,30.73 4.06,22.61 JP8.12
IO12  (via drill 0.3)
  Top 0.254: U1.15 28.81,29.23 v28.83,29.21
  Bottom 0.254: v28.83,29.21 13.34,29.21 4.19,20.07 JP8.13
IO13  (via drill 0.3)
  Top 0.254: U1.16 27,27 v26.8,26.8
  Bottom 0.254: v26.8,26.8 13.46,26.8 4.19,17.53 JP8.14
IO14  (via drill 0.3)
  Top 0.254: U1.17 29,28.53 v28.96,28.57
  Bottom 0.254: v28.96,28.57 28.07,27.69 28.07,26.16 27.56,25.65 13.72,25.65 3.05,14.99 JP8.15
IO15  (via drill 0.3)
  Top 0.254: U1.18 30.48,27 v30.48,28.57
  Bottom 0.254: v30.48,28.57 30.48,26.67 28.57,24.77 13.97,24.77 4.06,14.86 4.06,14.22 2.29,12.45 JP8.16
IO16  (via drill 0.3)
  Top 0.254: U1.19 v32,28.57
  Bottom 0.254: v32,28.57 32,27.05 28.7,23.75 14.48,23.75 4.83,14.1 4.83,11.18 3.56,9.91 JP8.17
IO17  (via drill 0.3)
  Top 0.254: U1.20 33.5,28.55 v33.53,28.57
  Bottom 0.254: v33.53,28.57 33.53,27.3 29.08,22.86 15.11,22.86 5.97,13.72 5.97,10.29 3.05,7.37 JP8.18
IO18_DISP  (via drill 0.3, 0.35)
  Top 0.254: U1.21 35,28.52 v35.05,28.57 | U$5.1 36.32,20.19 v39.48,23.35
  Bottom 0.254: v35.05,28.57 39.88,23.75 | 39.88,23.75 41.15,22.48 62.11,22.48 65.41,19.18 65.41,12.06 67.56,9.91 JP9.1 | v39.48,23.35 39.88,23.75
IO19  (via drill 0.3)
  Top 0.254: U1.22 36.5,28.5 v36.58,28.57 | R18.1 25.78,19.14 32.75,26.12 v32.75,30.23
  Bottom 0.254: JP9.2 67.82,12.45 65.79,14.48 65.79,19.34 62.27,22.86 42.23,22.86 36.58,28.51 v36.58,28.57 36.58,29.34 35.69,30.23 v32.75,30.23
IO20  (via drill 0.3)
  Top 0.254: U1.23 38,28.55 v37.97,28.57 | R17.1 23.75,18.63 31.25,26.12 v31.25,31.11
  Bottom 0.254: JP9.3 67.82,14.99 66.17,16.64 66.17,19.5 62.42,23.24 42.39,23.24 37.97,27.66 v37.97,28.57 37.97,30.35 37.21,31.11 v31.25,31.11
IO21_EXTMODE  (via drill 0.3)
  Top 0.254: v39.5,28.57 U1.24 39.5,25.53 34.67,20.7 U$6.1
  Bottom 0.254: v39.5,28.57 39.5,26.67 42.55,23.62 62.58,23.62 66.55,19.65 66.55,18.54 67.56,17.53 JP9.4
IO26  (via drill 0.3)
  Top 0.254: v41.02,28.57 41,28.55 U1.25
  Bottom 0.254: v41.02,28.57 45.59,24 62.74,24 66.67,20.07 JP9.5
IO33_EXTCOMIN  (via drill 0.3)
  Top 0.254: v44.58,26.8 44.5,26.87 U1.27 44.12,28.11 42.76,28.11 41.4,29.46 39.24,29.46 38.75,28.95 38.75,25.4 35.24,21.91 33.02,19.68 U$4.1
  Bottom 0.254: v44.58,26.8 62.61,26.8 66.8,22.61 JP9.6
IO34_SCS  (via drill 0.3)
  Top 0.254: U1.28 43.07,29.23 | 43.07,29.23 v43.05,29.21 | 43.07,29.23 41.95,30.35 38.35,30.35 37.25,29.14 37.25,25.74 34.5,23.04 31.37,19.91 U$3.1
  Bottom 0.254: v43.05,29.21 62.87,29.21 66.93,25.15 JP9.7
IO35_MOSI  (via drill 0.3)
  Top 0.254: U1.29 43.18,30.73 v43.05,30.61 42.42,31.24 37.59,31.24 35.75,29.34 35.7,29.3 35.7,25.92 29.59,19.81 U$2.1
  Bottom 0.254: v43.05,30.61 64.01,30.61 66.93,27.69 JP9.8
IO36_SCK  (via drill 0.3)
  Top 0.254: U1.30 43.08,32.23 v43.05,32.26 36.83,32.26 34.25,29.63 34.25,25.86 33.5,25.16 27.94,19.6 U$1.1
  Bottom 0.254: v43.05,32.26 45.49,32.26 55.91,42.67 62.14,42.67 64.77,40.04 64.77,32.64 67.18,30.23 JP9.9
IO37  (via drill 0.3)
  Top 0.254: U1.31 43.1,33.73 v43.05,33.78
  Bottom 0.254: v43.05,33.78 46.48,33.78 55.75,43.05 62.3,43.05 65.15,40.2 65.15,34.8 67.18,32.77 JP9.10
IO38  (via drill 0.3)
  Top 0.254: U1.32 43.1,35.23 v43.05,35.18
  Bottom 0.254: v43.05,35.18 47.34,35.18 55.59,43.43 62.45,43.43 65.58,40.31 65.58,36.78 67.06,35.31 JP9.11
IO39  (via drill 0.3)
  Top 0.254: U1.33 43.08,36.73 v43.05,36.7
  Bottom 0.254: v43.05,36.7 48.32,36.7 55.43,43.81 62.61,43.81 68.33,38.1 69.41,38.1 JP9.12
IO40  (via drill 0.3)
  Top 0.254: U1.34 v43.05,38.23
  Bottom 0.254: v43.05,38.23 49.31,38.23 55.28,44.2 64.01,44.2 67.82,40.39 JP9.13
IO41  (via drill 0.3)
  Top 0.254: U1.35 43.07,39.73 v43.05,39.75
  Bottom 0.254: v43.05,39.75 50.29,39.75 55.12,44.58 65.02,44.58 66.67,42.93 JP9.14
IO42  (via drill 0.3)
  Top 0.254: U1.36 43.13,41.23 v43.05,41.15
  Bottom 0.254: v43.05,41.15 51.05,41.15 54.86,44.96 61.59,44.96 62.1,45.47 JP9.15
IO45  (via drill 0.3)
  Top 0.254: v42.93,45.72 v42.94,45.73 U1.39 49.53,45.73 51.06,44.2
  Top 0.305: 51.06,44.2 U$9.2
  Bottom 0.254: v42.93,45.72 60.86,45.72 63.2,48.05 69.61,48.05 JP9.16
IO46  (via drill 0.3)
  Top 0.254: U1.40 44.32,47.23 v42.94,47.23 v42.93,47.24
  Bottom 0.254: v42.93,47.24 61.85,47.24 65.15,50.55 JP9.17
L_5V  (via drill 0.3)
  Top 0.254: 59.94,45.39 L1.2
  Top 0.406: 59.94,45.39 U5.5 v59.94,41.91 | U4.5 59.01,37.3 v59.94,38.23
  Bottom 0.406: v59.94,38.23 v59.94,41.91
MP_INT  (via drill 0.3)
  Top 0.254: U$8.1 53.78,10.22 54.48,10.92 54.48,11.43 | v54.48,13.34 54.48,11.43 | R14.1 49.95,11.43 54.48,11.43
  Top 0.305: U7.3 56.27,14.99 56.01,14.73 v56.01,13.34
  Top 0.406: U6.1 48.77,11.77 R14.1
  Bottom 0.406: v56.01,13.34 v54.48,13.34
N$1
  Top 0.254: J3.2 34,15.91 33.66,16.26 30.73,16.26 29.59,17.4 U$2.2
N$2  (via drill 3)
  other vias: 3,55
N$3  (via drill 3)
  other vias: 68.5,55
N$4
  Top 0.254: J3.3 34.5,15.95 33.81,16.64 32.13,16.64 31.37,17.4 U$3.2
N$5  (via drill 3)
  other vias: 68.5,3
N$6  (via drill 3)
  other vias: 3,3
N$7
  Top 0.254: J3.4 35,16.88 33.27,18.61 U$4.2
N$8
  Top 0.254: R2.2 9.06,35.39 Q1.3
N$10
  Top 0.254: U$6.2 34.67,18.54 37,16.21 J3.8
N$14
  Top 0.305: U7.2 55.91,15.49 55.41,14.99 55.41,11.39 56.9,9.91 58.29,9.91 59.14,9.06 R10.2 R9.1
N$17
  Top 0.406: R15.2 45.65,15.11 U6.5
N$18
  Top 0.305: U7.4 57.09,13.13 C12.1
N$28
  Top 0.406: T2.1 15.69,45.51 17.49,43.71 17.49,43.43 R12.2
N$52
  Top 0.406: T1.1 11.75,45.51 13.3,43.96 R11.2
RTS  (via drill 0.3)
  Top 0.254: T1.2 12.55,46.99 10.67,46.99 10.03,46.35 10.03,42.04 20.57,31.5 20.57,19.94 v20.7,19.81
  Top 0.406: R12.1 15.47,43.18 13.65,45 T1.2
  Bottom 0.254: v20.7,19.81 21.34,19.81 21.59,20.07 41.66,20.07 50.93,10.79 JP7.6
RXD0  (via drill 0.3)
  Top 0.254: U1.38 49.62,44.23 51.1,42.75 51.1,37.53 54.7,33.93 55.78,33.93 v55.88,33.83 | v57.53,33.78 65.02,33.78 66.55,32.26 66.55,8.13 63.5,5.08 57.02,5.08 56.01,4.06 JP7.4
  Bottom 0.254: v55.88,33.83 57.48,33.83 v57.53,33.78
SCK
  Top 0.254: J3.1 29.41,15.04 27.94,16.51 U$1.2
TXD0  (via drill 0.3)
  Top 0.254: U1.37 50.16,42.73 50.72,42.16 50.72,37.37 54.74,33.35 55.78,33.35 v55.88,33.25 | v57.53,33.2 57.66,33.2 57.78,33.33 64.94,33.33 66.17,32.1 66.17,8.29 63.34,5.46 55.37,5.46 53.47,3.56 JP7.5
  Bottom 0.254: v55.88,33.25 57.48,33.25 v57.53,33.2
USB_CC1  (via drill 0.3)
  Top 0.305: J6.A5 21.36,7.81 v18.67,10.5 | R19.2 16.8,12.57 v17.78,12.57
  Bottom 0.305: v18.67,10.5 18.67,12.19 | 18.67,12.19 18.67,12.32 19.12,12.77 20.62,12.77 21.25,13.4 J5.P$5 | v17.78,12.57 18.29,12.57 18.67,12.19
USB_CC2  (via drill 0.3)
  Top 0.305: J6.B5 24.36,7.72 27.18,10.54 v27.18,12.32 27.22,12.28 R20.2
  Bottom 0.305: J5.P$12 23.96,12.27 24.38,12.7 26.16,12.7 26.54,12.32 v27.18,12.32

### Text on the board
tPlace: G / N / D / / 3 / V / 3 | G / N / D / / 3 / V / 3 | IO0 / / IO1 / / IO2 / / IO3 / / IO4 / / IO5 / / IO6 / / IO7 / / IO8 / / IO9 / / IO10 / / IO11 / / IO12 / / IO13 / / IO14 / / IO15 / / IO16 / / IO17 | IO46 / / IO45 / / IO42 / / IO41 / / IO40 / / IO39 / / IO38 / / IO37 / / IO36 / / IO35 / / IO34 / / IO33 / / IO26 / / IO21 / / IO20 / / IO19 / / IO18 | BOOT | RESET | CE_IO45 | StepUp 5V / Use U4 / U5 | LDO 3V3 / Use U2 / U3 | twitch.tv/bastlir / ESP32-S2 / SharpMemoryLcd v1 / 2021-01 | U2 | <- UB+BAT / <- UB+VUSB | 5V+VUSB -> | SCK / / MOSI / / SCS / / EXTCOMIN / / EXTMODE / / DISP | 36 / / 35 / / 34 / / 33 / / 21 / / 18 | BATTERY / + - | MP_INT / IO10 | | / Chg. curr: / 2k0=500mA / 4k7=212mA | Li-Ion Chg / Use U6/U7 | RTS / / TXD / / RXD / / 3V3 / / DTR / / GND | - +5V | Text
bPlace: LS027B7DH01A / Sharp MemoryLCD / 2.7" 400 x 240